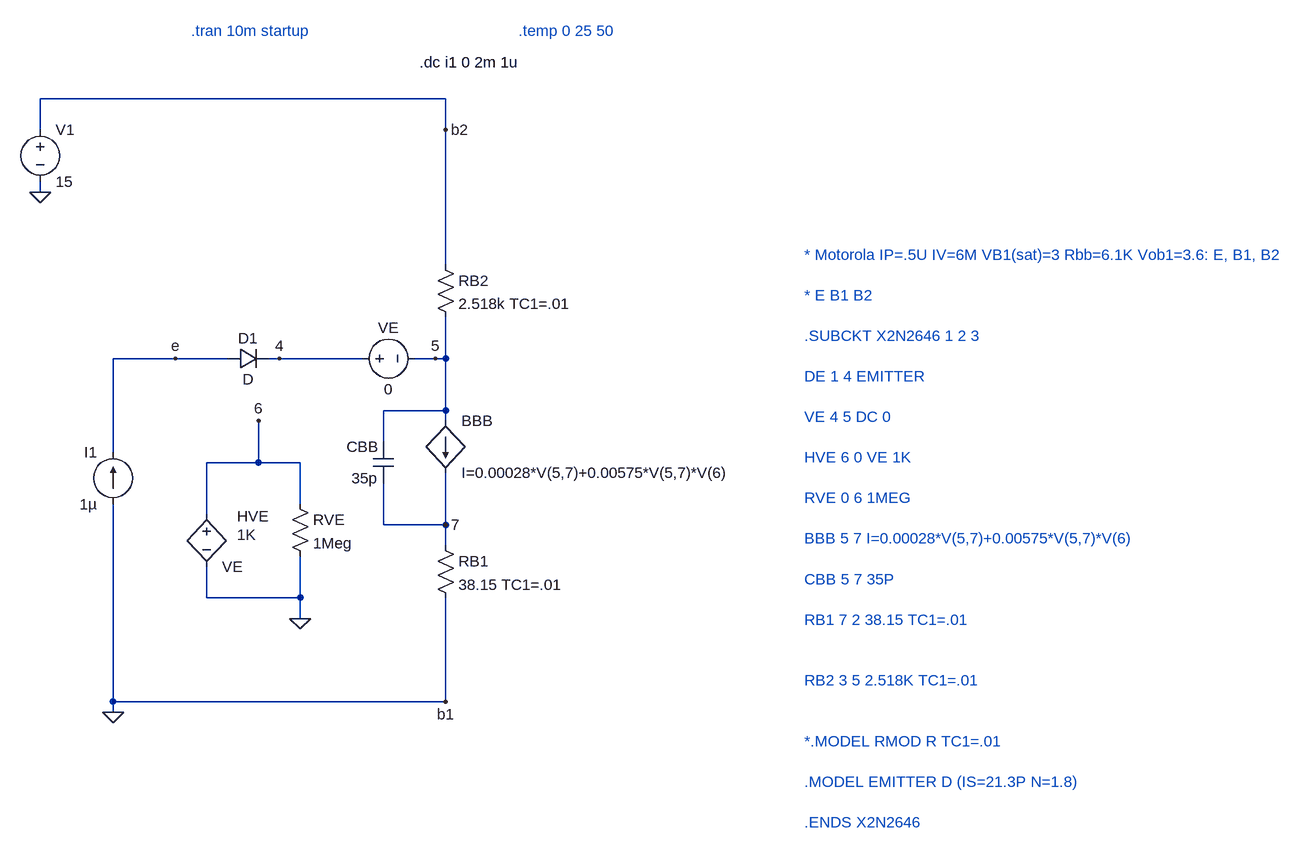
[diagram p0: schematic ujt4.asc]
ujt4.asc, the LTspice schematic file:
Version 4
SHEET 1 992 812
WIRE -368 -192 -992 -192
WIRE -992 -144 -992 -192
WIRE -368 -144 -368 -192
WIRE -992 -48 -992 -64
WIRE -368 64 -368 -144
WIRE -784 208 -880 208
WIRE -704 208 -784 208
WIRE -624 208 -640 208
WIRE -496 208 -624 208
WIRE -384 208 -416 208
WIRE -368 208 -368 144
WIRE -368 208 -384 208
WIRE -368 288 -368 208
WIRE -368 288 -464 288
WIRE -368 304 -368 288
WIRE -464 336 -464 288
WIRE -880 352 -880 208
WIRE -656 368 -656 304
WIRE -656 368 -736 368
WIRE -592 368 -656 368
WIRE -592 432 -592 368
WIRE -736 448 -736 368
WIRE -464 464 -464 400
WIRE -368 464 -368 384
WIRE -368 464 -464 464
WIRE -368 496 -368 464
WIRE -736 576 -736 528
WIRE -592 576 -592 512
WIRE -592 576 -736 576
WIRE -592 608 -592 576
WIRE -880 736 -880 432
WIRE -368 736 -368 576
WIRE -368 736 -880 736
WIRE -880 752 -880 736
FLAG -784 208 e
FLAG -368 736 b1
FLAG -624 208 4
FLAG -384 208 5
FLAG -368 464 7
FLAG -368 -144 b2
FLAG -592 608 0
FLAG -880 752 0
FLAG -992 -48 0
FLAG -656 304 6
SYMBOL diode -704 224 R270
WINDOW 0 32 32 VTop 2
WINDOW 3 0 32 VBottom 2
SYMATTR InstName D1
SYMBOL voltage -512 208 R270
WINDOW 0 32 56 VTop 2
WINDOW 3 -32 56 VBottom 2
WINDOW 123 0 0 Left 0
WINDOW 39 0 0 Left 0
SYMATTR InstName VE
SYMATTR Value 0
SYMBOL res -384 48 R0
SYMATTR InstName RB2
SYMATTR Value 2.518k TC1=.01
SYMBOL res -384 480 R0
SYMATTR InstName RB1
SYMATTR Value 38.15 TC1=.01
SYMBOL bi -368 304 R0
SYMATTR InstName BBB
SYMATTR Value I=0.00028*V(5,7)+0.00575*V(5,7)*V(6)
SYMBOL cap -448 400 R180
WINDOW 0 24 56 Left 2
WINDOW 3 24 8 Left 2
SYMATTR InstName CBB
SYMATTR Value 35p
SYMBOL h -736 432 R0
WINDOW 0 47 19 Left 2
WINDOW 123 47 47 Left 2
SYMATTR InstName HVE
SYMATTR Value2 1K
SYMATTR Value VE
SYMBOL res -608 416 R0
SYMATTR InstName RVE
SYMATTR Value 1Meg
SYMBOL voltage -992 -160 R0
WINDOW 123 0 0 Left 0
WINDOW 39 0 0 Left 0
SYMATTR InstName V1
SYMATTR Value 15
SYMBOL current -880 432 R180
WINDOW 0 24 80 Left 2
WINDOW 3 24 0 Left 2
WINDOW 123 0 0 Left 0
WINDOW 39 0 0 Left 0
SYMATTR InstName I1
SYMATTR Value 1µ
TEXT 184 48 Left 2 ;* Motorola IP=.5U IV=6M VB1(sat)=3 Rbb=6.1K Vob1=3.6: E, B1, B2\n\n* E B1 B2\n\n.SUBCKT X2N2646 1 2 3\n\nDE 1 4 EMITTER\n\nVE 4 5 DC 0\n\nHVE 6 0 VE 1K\n\nRVE 0 6 1MEG\n\nBBB 5 7 I=0.00028*V(5,7)+0.00575*V(5,7)*V(6)\n\nCBB 5 7 35P\n\nRB1 7 2 38.15 TC1=.01\n\n\nRB2 3 5 2.518K TC1=.01\n\n\n*.MODEL RMOD R TC1=.01\n\n.MODEL EMITTER D (IS=21.3P N=1.8)\n\n.ENDS X2N2646
TEXT -760 -296 Left 2 ;.tran 10m startup
TEXT -256 -296 Left 2 ;.temp 0 25 50
TEXT -408 -248 Left 2 !.dc i1 0 2m 1u

The netlist it stands for:
* ujt4.asc
D1 e 4 D
VE 4 5 0
RB2 b2 5 2.518k TC1=.01
RB1 7 0 38.15 TC1=.01
BBB 5 7 I=0.00028*V(5,7)+0.00575*V(5,7)*V(6)
CBB 7 5 35p
HVE 6 0 VE 1K
RVE 6 0 1Meg
V1 b2 0 15
I1 0 e 1µ
.model D D
.lib standard.dio
* * Motorola IP=.5U IV=6M VB1(sat)=3 Rbb=6.1K Vob1=3.6: E, B1, B2
* * E B1 B2
* .SUBCKT X2N2646 1 2 3
* DE 1 4 EMITTER
* VE 4 5 DC 0
* HVE 6 0 VE 1K
* RVE 0 6 1MEG
* BBB 5 7 I=0.00028*V(5,7)+0.00575*V(5,7)*V(6)
* CBB 5 7 35P
* RB1 7 2 38.15 TC1=.01
* RB2 3 5 2.518K TC1=.01
* *.MODEL RMOD R TC1=.01
* .MODEL EMITTER D (IS=21.3P N=1.8)
* .ENDS X2N2646
* .tran 10m startup
* .temp 0 25 50
.dc i1 0 2m 1u
.backanno
.end